# Altium schematic sheet Voltage_Regulators.SchDoc: =SheetTitle
size B; SheetTitle: Voltage Regulators; DrawnBy: Samyar Sadat Akhavi; DocumentNumber: 10; SheetNumber: 10; SheetTotal: 19
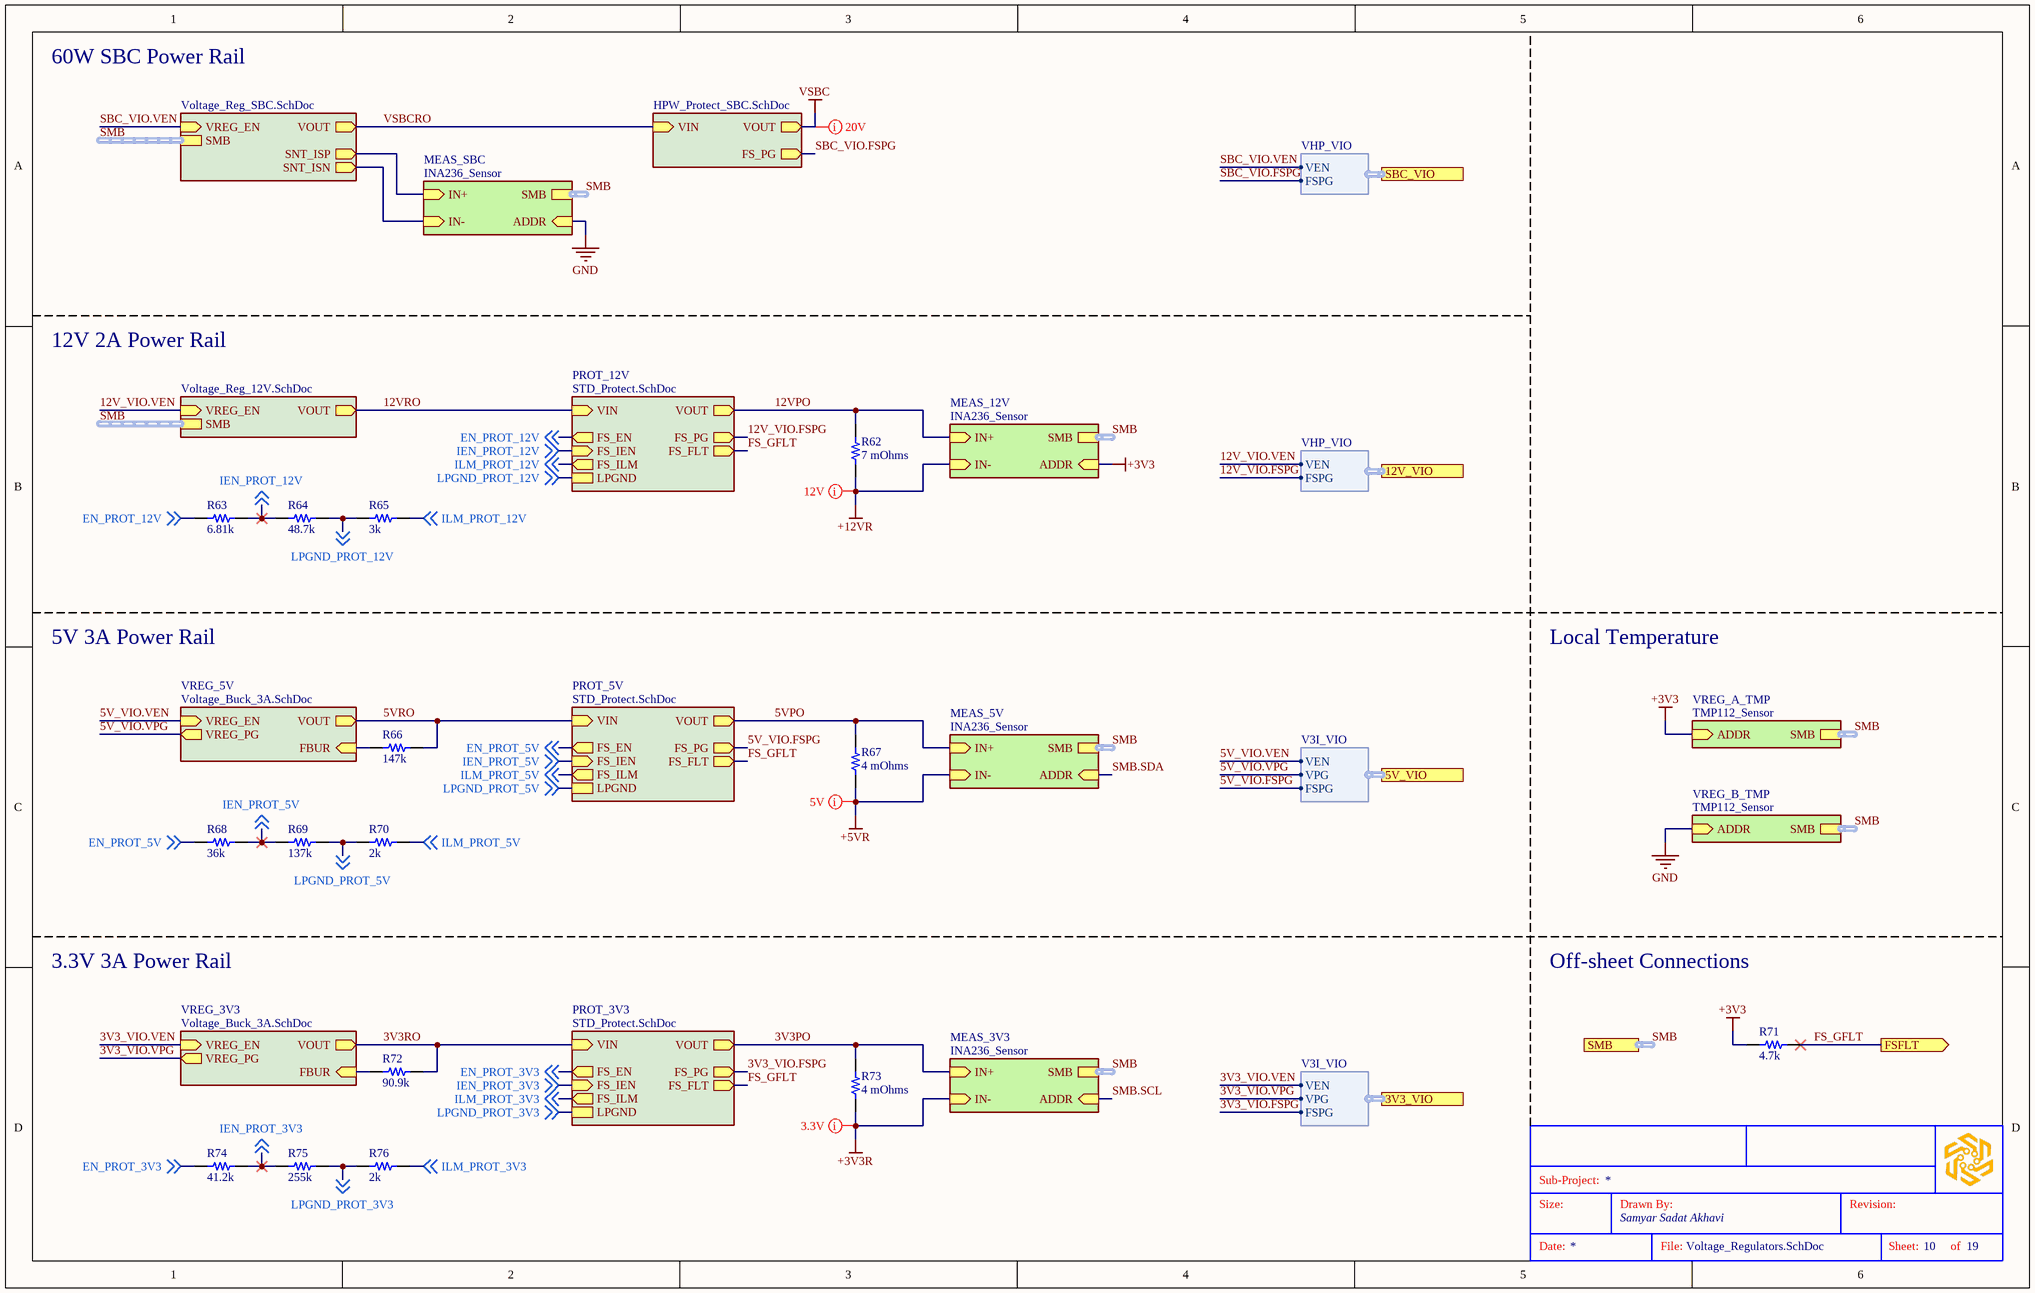
[diagram p0: Voltage_Regulators.SchDoc]

## Parts
?  (no value)  (graphical)
R62  7 mOhms  [RES 1206_3216]
R63  6.81k  [RES 0603_1608]
R64  48.7k  [RES 0603_1608]
R65  3k  [RES 0603_1608]
R66  147k  [RES 0603_1608]
R67  4 mOhms  [RES 1206_3216]
R68  36k  [RES 0603_1608]
R69  137k  [RES 0603_1608]
R70  2k  [RES 0603_1608]
R71  4.7k  [RES 0603_1608]
R72  90.9k  [RES 0603_1608]
R73  4 mOhms  [RES 1206_3216]
R74  41.2k  [RES 0603_1608]
R75  255k  [RES 0603_1608]
R76  2k  [RES 0603_1608]

## Sub-sheets
MEAS_3V3 = INA236_Sensor: IN- (in), ADDR (in), SMB (harness SMBus), IN+ (in)
MEAS_5V = INA236_Sensor: IN- (in), ADDR (in), SMB (harness SMBus), IN+ (in)
MEAS_12V = INA236_Sensor: IN- (in), ADDR (in), SMB (harness SMBus), IN+ (in)
MEAS_SBC = INA236_Sensor: IN- (in), ADDR (in), SMB (harness SMBus), IN+ (in)
PROT_3V3 = STD_Protect.SchDoc: FS_PG (out), FS_FLT (out), VIN (in), VOUT (out), FS_IEN (in), FS_ILM (out), LPGND, FS_EN (out)
PROT_5V = STD_Protect.SchDoc: FS_PG (out), FS_FLT (out), VIN (in), VOUT (out), FS_EN (out), FS_IEN (in), FS_ILM (out), LPGND
PROT_12V = STD_Protect.SchDoc: FS_PG (out), FS_FLT (out), VIN (in), VOUT (out), FS_IEN (in), FS_ILM (out), LPGND, FS_EN (out)
PROT_SBC = HPW_Protect_SBC.SchDoc: VIN (in), VOUT (out), FS_PG (out)
VREG_3V3 = Voltage_Buck_3A.SchDoc: VREG_EN (in), VOUT (out), VREG_PG (out), FBUR (in)
VREG_5V = Voltage_Buck_3A.SchDoc: VREG_EN (in), VOUT (out), VREG_PG (out), FBUR (in)
VREG_12V = Voltage_Reg_12V.SchDoc: SMB (harness SMBus), VREG_EN (in), VOUT (out)
VREG_A_TMP = TMP112_Sensor: ADDR (in), SMB (harness SMBus)
VREG_B_TMP = TMP112_Sensor: ADDR (in), SMB (harness SMBus)
VREG_SBC = Voltage_Reg_SBC.SchDoc: SMB (harness SMBus), VOUT (out), VREG_EN (in), SNT_ISN (out), SNT_ISP (out)

## Ports
3V3_VIO (harness V3I_VIO, see Power_Board[3B], Microcontroller[4B]), 5V_VIO (harness V3I_VIO, see Power_Board[3B], Microcontroller[4B]), 12V_VIO (harness VHP_VIO, see Power_Board[3B], Microcontroller[4A]), FSFLT (out, see Power_Board[3B]), SBC_VIO (harness VHP_VIO, see Power_Board[3B], Microcontroller[4A]), SMB (harness SMBus, see Power_Board[3B], INA236_Sensor[3B], TMP112_Sensor[3B], Voltage_Reg_12V[2C], Voltage_Reg_SBC[1B])

## Harnesses
V3I_VIO: VEN, VPG, FSPG
VHP_VIO: VEN, FSPG

## Nets
+3V3: R71.1 ; sheet VREG_A_TMP/ADDR, sheet MEAS_12V/ADDR
+3V3R: R73.1 ; sheet MEAS_3V3/IN-
+5VR: R67.1 ; sheet MEAS_5V/IN-
+12VR: R62.1 ; sheet MEAS_12V/IN-
GND: sheet VREG_B_TMP/ADDR, sheet MEAS_SBC/ADDR
VSBC: sheet PROT_SBC/VOUT
3V3_VIO.FSPG: sheet PROT_3V3/FS_PG, port 3V3_VIO.FSPG
3V3_VIO.VEN: sheet VREG_3V3/VREG_EN, port 3V3_VIO.VEN
3V3_VIO.VPG: sheet VREG_3V3/VREG_PG, port 3V3_VIO.VPG
3V3PO: R73.2 ; sheet PROT_3V3/VOUT, sheet MEAS_3V3/IN+
3V3RO: R72.1 ; sheet PROT_3V3/VIN, sheet VREG_3V3/VOUT
5V_VIO.FSPG: sheet PROT_5V/FS_PG, port 5V_VIO.FSPG
5V_VIO.VEN: sheet VREG_5V/VREG_EN, port 5V_VIO.VEN
5V_VIO.VPG: sheet VREG_5V/VREG_PG, port 5V_VIO.VPG
5VPO: R67.2 ; sheet PROT_5V/VOUT, sheet MEAS_5V/IN+
5VRO: R66.2 ; sheet PROT_5V/VIN, sheet VREG_5V/VOUT
12V_VIO.FSPG: sheet PROT_12V/FS_PG, port 12V_VIO.FSPG
12V_VIO.VEN: sheet VREG_12V/VREG_EN, port 12V_VIO.VEN
12VPO: R62.2 ; sheet PROT_12V/VOUT, sheet MEAS_12V/IN+
12VRO: sheet VREG_12V/VOUT, sheet PROT_12V/VIN
EN_PROT_3V3: R74.2 ; off-sheet EN_PROT_3V3, sheet PROT_3V3/FS_EN
EN_PROT_5V: R68.1 ; off-sheet EN_PROT_5V, sheet PROT_5V/FS_EN
EN_PROT_12V: R63.1 ; off-sheet EN_PROT_12V, sheet PROT_12V/FS_EN
FS_GFLT: R71.2 ; port FSFLT, sheet PROT_3V3/FS_FLT, sheet PROT_12V/FS_FLT, sheet PROT_5V/FS_FLT
IEN_PROT_3V3: R74.1 R75.2 ; off-sheet IEN_PROT_3V3, sheet PROT_3V3/FS_IEN
IEN_PROT_5V: R68.2 R69.1 ; off-sheet IEN_PROT_5V, sheet PROT_5V/FS_IEN
IEN_PROT_12V: R63.2 R64.1 ; off-sheet IEN_PROT_12V, sheet PROT_12V/FS_IEN
ILM_PROT_3V3: R76.1 ; off-sheet ILM_PROT_3V3, sheet PROT_3V3/FS_ILM
ILM_PROT_5V: R70.1 ; off-sheet ILM_PROT_5V, sheet PROT_5V/FS_ILM
ILM_PROT_12V: R65.2 ; off-sheet ILM_PROT_12V, sheet PROT_12V/FS_ILM
LPGND_PROT_3V3: R75.1 R76.2 ; off-sheet LPGND_PROT_3V3, sheet PROT_3V3/LPGND
LPGND_PROT_5V: R69.2 R70.2 ; off-sheet LPGND_PROT_5V, sheet PROT_5V/LPGND
LPGND_PROT_12V: R64.2 R65.1 ; off-sheet LPGND_PROT_12V, sheet PROT_12V/LPGND
SBC_VIO.FSPG: sheet PROT_SBC/FS_PG, port SBC_VIO.FSPG
SBC_VIO.VEN: sheet VREG_SBC/VREG_EN, port SBC_VIO.VEN
SMB.SCL: sheet MEAS_3V3/ADDR
SMB.SDA: sheet MEAS_5V/ADDR
VSBCRO: sheet VREG_SBC/VOUT, sheet PROT_SBC/VIN
NetR66_1: R66.1 ; sheet VREG_5V/FBUR
NetR72_2: R72.2 ; sheet VREG_3V3/FBUR
(unnamed): sheet VREG_SBC/SNT_ISN, sheet MEAS_SBC/IN-
(unnamed): sheet VREG_SBC/SNT_ISP, sheet MEAS_SBC/IN+

## Buses and harness runs
harness SMB = port SMB
harness SMB = sheet MEAS_3V3/SMB
harness SMB = sheet MEAS_5V/SMB
harness SMB = sheet MEAS_12V/SMB
harness SMB = sheet MEAS_SBC/SMB
harness SMB = sheet VREG_12V/SMB
harness SMB = sheet VREG_A_TMP/SMB
harness SMB = sheet VREG_B_TMP/SMB
harness SMB = sheet VREG_SBC/SMB

## Layout directives
rule Supply Nets [Voltage = 20.00]: VSBC
rule Supply Nets [Voltage = 12.00]: +12VR
rule Supply Nets [Voltage = 5.000]: +5VR
rule Supply Nets [Voltage = 3.300]: +3V3R

## Notes on the sheet
- 60W SBC Power Rail
- 12V 2A Power Rail
- 5V 3A Power Rail
- Local Temperature
- 3.3V 3A Power Rail
- Off-sheet Connections
- Sub-Project:
- Size:
- Drawn By:
- Revision:
- Date:
- File:
- Sheet:
- of

## Library data of the parts
? = SGR-STDTBSB: STANDARD SCHEMATICS TITLE BLOCK
R62 = TLR2B10DR007FTDG: RES 0.007 OHM 1% 1W 1206; Manufacturer: TE Connectivity Passive Product; Temperature Coefficient: ±50ppm/°C; Part Number: TLR2B10DR007FTDG; ComponentLink1Description: Datasheet; ComponentLink1URL: https://www.te.com/commerce/DocumentDelivery/DDEController?Action=srchrtrv&DocNm=1773449-3&DocType=DS&DocLang=English; ComponentLink2Description: DigiKey Link; ComponentLink2URL: https://www.digikey.com/en/products/detail/te-connectivity-passive-product/TLR2B10DR007FTDG/5584869; Composition: Metal Foil; Device Package: 1206 (3216 Metric); Features: Current Sense; Height - Seated (Max): 0.024" (0.60mm); LastUpdated: 4/6/2026 8:00:51 PM; Lifecycle Status: Active; Minimum Order: 1; Number of Terminations: 2; Operating Temperature: -55°C ~ 170°C; Package / Case: 1206 (3216 Metric); Packaging: TapeAndReel; PartId: 27144; Part Status: Active; Power (Watts): 1W; Price: 0.32; Resistance: 7 mOhms; Series: TLR, CGS; Size / Dimension: 0.126" L x 0.063" W (3.20mm x 1.60mm); Supplier 1: DigiKey; Supplier Part Number 1: A131747CT-ND; Supplier Device Package: 1206; Tolerance: ±1%; Value: 7 mOhms
R63 = GEN-CRR6K81T1P8603: GENERIC 0603 CHIP RESISTOR; Tolerance: ±1%; Power: 0.125W; Part Number: GEN-CRR6K81T1P8603; Value: 6.81k
R64 = GEN-CRR48K7T1P8603: GENERIC 0603 CHIP RESISTOR; Tolerance: ±1%; Power: 0.125W; Part Number: GEN-CRR48K7T1P8603; Value: 48.7k
R65 = GEN-CRR3KT1P8603: GENERIC 0603 CHIP RESISTOR; Tolerance: ±1%; Power: 0.125W; Part Number: GEN-CRR3KT1P8603; Value: 3k
R66 = GEN-CRR147KT1P8603: GENERIC 0603 CHIP RESISTOR; Tolerance: ±1%; Power: 0.125W; Part Number: GEN-CRR147KT1P8603; Value: 147k
R67 R73 = TLR2B10DR004FTDG: RES 0.004 OHM 1% 1W 1206; Manufacturer: TE Connectivity Passive Product; Temperature Coefficient: ±50ppm/°C; Part Number: TLR2B10DR004FTDG; ComponentLink1Description: Datasheet; ComponentLink1URL: https://www.te.com/commerce/DocumentDelivery/DDEController?Action=srchrtrv&DocNm=1773449-3&DocType=DS&DocLang=English; ComponentLink2Description: DigiKey Link; ComponentLink2URL: https://www.digikey.com/en/products/detail/te-connectivity-passive-product/TLR2B10DR004FTDG/5584867; Composition: Metal Foil; Device Package: 1206 (3216 Metric); Features: Current Sense; Height - Seated (Max): 0.024" (0.60mm); LastUpdated: 4/6/2026 7:59:33 PM; Lifecycle Status: Active; Minimum Order: 1; Number of Terminations: 2; Operating Temperature: -55°C ~ 170°C; Package / Case: 1206 (3216 Metric); Packaging: TapeAndReel; PartId: 42701; Part Status: Active; Power (Watts): 1W; Price: 0.31; Resistance: 4 mOhms; Series: TLR, CGS; Size / Dimension: 0.126" L x 0.063" W (3.20mm x 1.60mm); Supplier 1: DigiKey; Supplier Part Number 1: A129560CT-ND; Supplier Device Package: 1206; Tolerance: ±1%; Value: 4 mOhms
R68 = GEN-CRR36KT1P8603: GENERIC 0603 CHIP RESISTOR; Tolerance: ±1%; Power: 0.125W; Part Number: GEN-CRR36KT1P8603; Value: 36k
R69 = GEN-CRR137KT1P8603: GENERIC 0603 CHIP RESISTOR; Tolerance: ±1%; Power: 0.125W; Part Number: GEN-CRR137KT1P8603; Value: 137k
R70 R76 = GEN-CRR2KT1P8603: GENERIC 0603 CHIP RESISTOR; Tolerance: ±1%; Power: 0.125W; Part Number: GEN-CRR2KT1P8603; Value: 2k
R71 = GEN-CRR4K7T5P8603: GENERIC 0603 CHIP RESISTOR; Tolerance: ±5%; Power: 0.125W; Part Number: GEN-CRR4K7T5P8603; Value: 4.7k
R72 = GEN-CRR90K9T1P8603: GENERIC 0603 CHIP RESISTOR; Tolerance: ±1%; Power: 0.125W; Part Number: GEN-CRR90K9T1P8603; Value: 90.9k
R74 = GEN-CRR41K2T1P8603: GENERIC 0603 CHIP RESISTOR; Tolerance: ±1%; Power: 0.125W; Part Number: GEN-CRR41K2T1P8603; Value: 41.2k
R75 = GEN-CRR255KT1P8603: GENERIC 0603 CHIP RESISTOR; Tolerance: ±1%; Power: 0.125W; Part Number: GEN-CRR255KT1P8603; Value: 255k